# EAGLE design Engine_Tachometer (EAGLE 9.6.2)
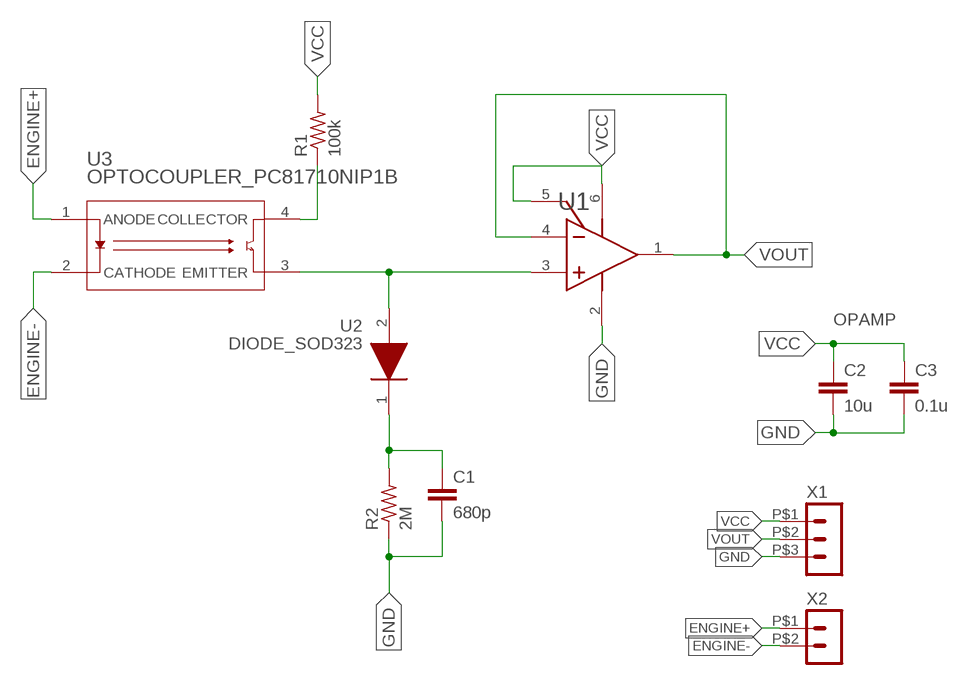
[diagram p0: schematic, sheet 1]

## Parts
C1  680p  CAP_SMDC0603  [C0603]
C2  10u  CAP_SMDC1206  [C1206]
C3  0.1u  CAP_SMDC0603  [C0603]
R1  100k  RES_SMDR1206  [R1206]
R2  2M  RES_SMDR0603  [R0603]
U1  OPAMP_LMH6611MKE  [MK06A]
U2  DIODE_SOD323  [SOD-323_1P8X1P35_ONS]
U3  OPTOCOUPLER_PC81710NIP1B  [SOP_PC8171_SCT]
X1  HEADER_POS3_43650-0300  [43650-0300]
X2  HEADER_POS2_43650-0200  [43650-0200]

## Nets
ENGINE+: U3.1(ANODE) X2.P$1
ENGINE-: U3.2(CATHODE) X2.P$2
GND: C1.2 C2.2 C3.2 R2.1 U1.2(V-) X1.P$3
N$2: R1.1 U3.4(COLLECTOR)
N$4: U1.3(IN+) U2.2 U3.3(EMITTER)
N$5: C1.1 R2.2 U2.1
VCC: C2.1 C3.1 R1.2 U1.5(~DIS) U1.6(V+) X1.P$1
VOUT: U1.1(OUT) U1.4(IN-) X1.P$2

## Notes on the sheet
- OPAMP

## Library data of the parts
C1-C3 = GTOR - Passive Components:CAP_SMD: CAPACITOR, European symbol; SPICEPREFIX: C
R1 R2 = GTOR - Passive Components:RES_SMD: RESISTOR, American symbol; SPICEPREFIX: R
U1 = GTOR - Active Components:OPAMP_LMH6611MKE: General Purpose Amplifier 1 Circuit Rail-to-Rail TSOT-23-6; COPYRIGHT: Copyright (C) 2022 Ultra Librarian. All rights reserved.; DIGI-KEY_PART_NUMBER_1: LMH6611MKE/NOPBCT-ND; DIGI-KEY_PART_NUMBER_2: LMH6611MKE/NOPBDKR-ND; DIGI-KEY_PART_NUMBER_3: LMH6611MKE/NOPBTR-ND; DIGI-KEY_PART_NUMBER_4: 2156-LMH6611MKE/NOPB-ND; MANUFACTURER_PART_NUMBER: LMH6611MKE/NOPB; MFR_NAME: Texas Instruments
U2 = GTOR - Passive Components:DIODE_SOD323; COPYRIGHT: Copyright (C) 2022 Ultra Librarian. All rights reserved.; MANUFACTURER_PART_NUMBER: MM3Z33VT1G; MFR_NAME: onsemi
U3 = GTOR - Active Components:OPTOCOUPLER_PC81710NIP1B; COPYRIGHT: Copyright (C) 2022 Ultra Librarian. All rights reserved.; DIGI-KEY_PART_NUMBER_1: 1855-1014-1-ND; DIGI-KEY_PART_NUMBER_2: 1855-1014-2-ND; DIGI-KEY_PART_NUMBER_3: 1855-1014-6-ND; MANUFACTURER_PART_NUMBER: PC81710NIP1B; MFR_NAME: SOCLE Technology
X1 = GTOR - Microfit Connector:HEADER_POS3_?: Molex - Micro-Fit 3.0 Series connector, 3.00mm (0.118") pitch header, 3 positions.
X2 = GTOR - Microfit Connector:HEADER_POS2_?: Molex - Micro-Fit 3.0 Series connector, 3.00mm (0.118") pitch header, 2 positions.

## Board
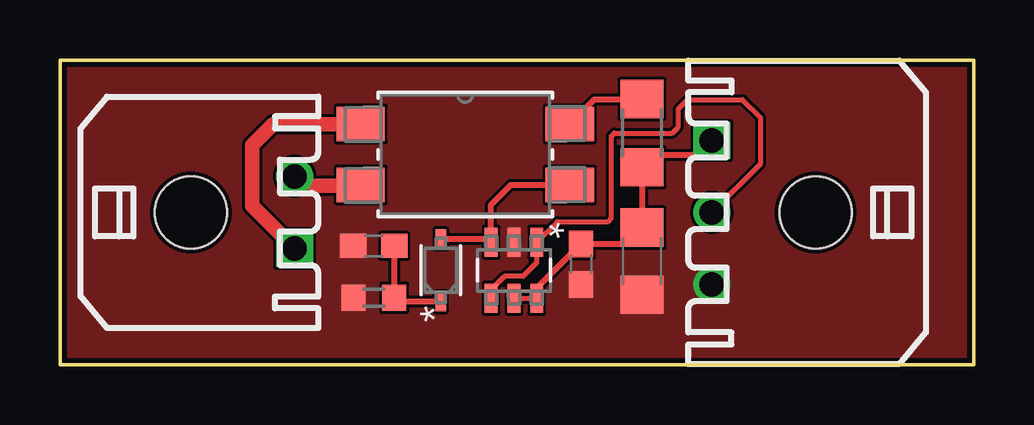
[diagram p1: board, top side]
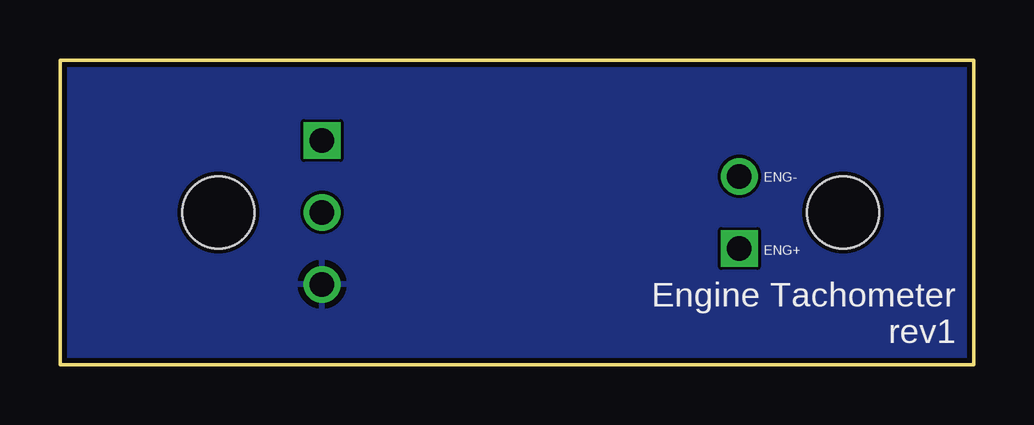
[diagram p2: board, bottom side, seen from below]

Size 38.1 x 12.7 mm. Coordinates in mm from the lower left corner, seen from the top.
Outline: 0,0 38.1,0 38.1,12.7 0,12.7 0,0
Copper layers (1*16): Top 0.035mm / dielectric 1.6mm / Bottom 0.035mm
Design rules "designrulecheck_jlcpcb_2layers": minimum track width 5mil, minimum drill 0.3mm, track to track 5mil, track to pad 0.2mm, pad to pad 5mil, via to via 10mil, smd to smd 5mil, copper to edge 0.2mm, drill to drill 0.5mm, minimum pad ring 10mil, minimum via ring 0.3mm, stop-mask expansion 4mil, vias tented up to drill 0mil, thermal gap 10mil

### Footprints (pad centres in the part's own frame; a part is rotated, then mirrored left to right if it is on the bottom)
C0603 = smd 1.1 x 1: 1 -0.85,0; 2 0.85,0
C1206 = smd 1.6 x 1.8: 1 -1.4,0; 2 1.4,0
R1206 = smd 1.6 x 1.803: 1 -1.422,0; 2 1.422,0
R0603 = smd 1 x 1.1: 1 -0.85,0; 2 0.85,0
MK06A = smd 1.219 x 0.533: 1 -1.168,0.95; 2 -1.168,0; 3 -1.168,-0.95; 4 1.168,-0.95; 5 1.168,0; 6 1.168,0.95
SOD-323_1P8X1P35_ONS = smd 0.787 x 0.457: 1 -1.308,0; 2 1.308,0
SOP_PC8171_SCT = smd 2.007 x 1.448: 1 -4.356,1.27; 2 -4.356,-1.27; 3 4.356,-1.27; 4 4.356,1.27
43650-0300 = drill 1.02 square: P$1 3,4.32 | drill 1.02: P$2 0,4.32; P$3 -3,4.32 | hole 3: 0,0
43650-0200 = drill 1.02 square: P$1 1.5,4.32 | drill 1.02: P$2 -1.5,4.32 | hole 3: 0,0

### Placement (x,y rotation side)
C1  13.08,4.95 180 top
C2  24.26,4.32 270 top
C3  21.72,4.19 270 top
R1  24.26,9.65 270 top
R2  13.08,2.79 0 top
U1  18.92,3.94 270 top
U2  15.88,3.94 90 top
U3  16.89,8.76 0 top
X1  31.5,6.35 90 top
X2  5.46,6.35 270 top

### Tracks (layer width: path | path; a pad name or v marks a point on that pad's centre or on a via)
ENGINE+
  Top 0.61: X2.P$1 8,6.63 8,9.14 8.89,10.03 U3.1
ENGINE-
  Top 0.61: X2.P$2 10.16,7.47 12.51,7.47 U3.2
GND
  pour Top (no thermals): -4.7,16.51 41.02,16.51 41.02,-2.29 -4.7,-2.29
  pour Bottom: -5.71,17.27 43.31,17.27 43.31,-3.3 -5.71,-3.3
N$2
  Top 0.254: U3.4 22.26,11.05 24.23,11.05 R1.1
N$4
  Top 0.254: U2.2 17.83,5.25 U1.3 17.97,6.67 18.8,7.49 U3.3
N$5
  Top 0.254: U2.1 14.1,2.63 R2.2 C1.1
VCC
  Top 0.203: U1.5 U1.6
  Top 0.254: U1.6 19.87,3.2 C3.1 23.58,5.04 C2.1 R1.2 24.77,8.74 26.56,8.74 X1.P$1
VOUT
  Top 0.203: X1.P$2 29.21,8.38 29.21,10.29 28.45,11.05 26.16,11.05 25.78,10.67 25.78,9.91 25.53,9.65 23.11,9.65 22.99,9.53 22.99,6.1 22.86,5.97 20.74,5.97 U1.1 19.87,4.25 19.3,3.68 18.54,3.68 17.97,3.12 U1.4

### Text on the board
bPlace: ENG- | ENG+
bNames: Engine Tachometer / rev1